# Altium schematic sheet Management.SchDoc: SVPXFMC Carrier 3U
size A4; CheckedBy: \; Author: G.Kasprowicz; CompanyName: ISE; DrawnBy: T.Przywozki; Organization: WUT ISE; Address1: Warsaw University of Technology; Address2: Nowowiejska 15/19 00-665 Warsaw; Revision: 1.0.; SheetNumber: 16; SheetTotal: 20; Project: SVPXFMC Carrier 3U; ModifiedBy: -; CheckedDate: -; Title2: MSP430 management MCU; DivGrp: ISE; Designer: G. Kasprowicz
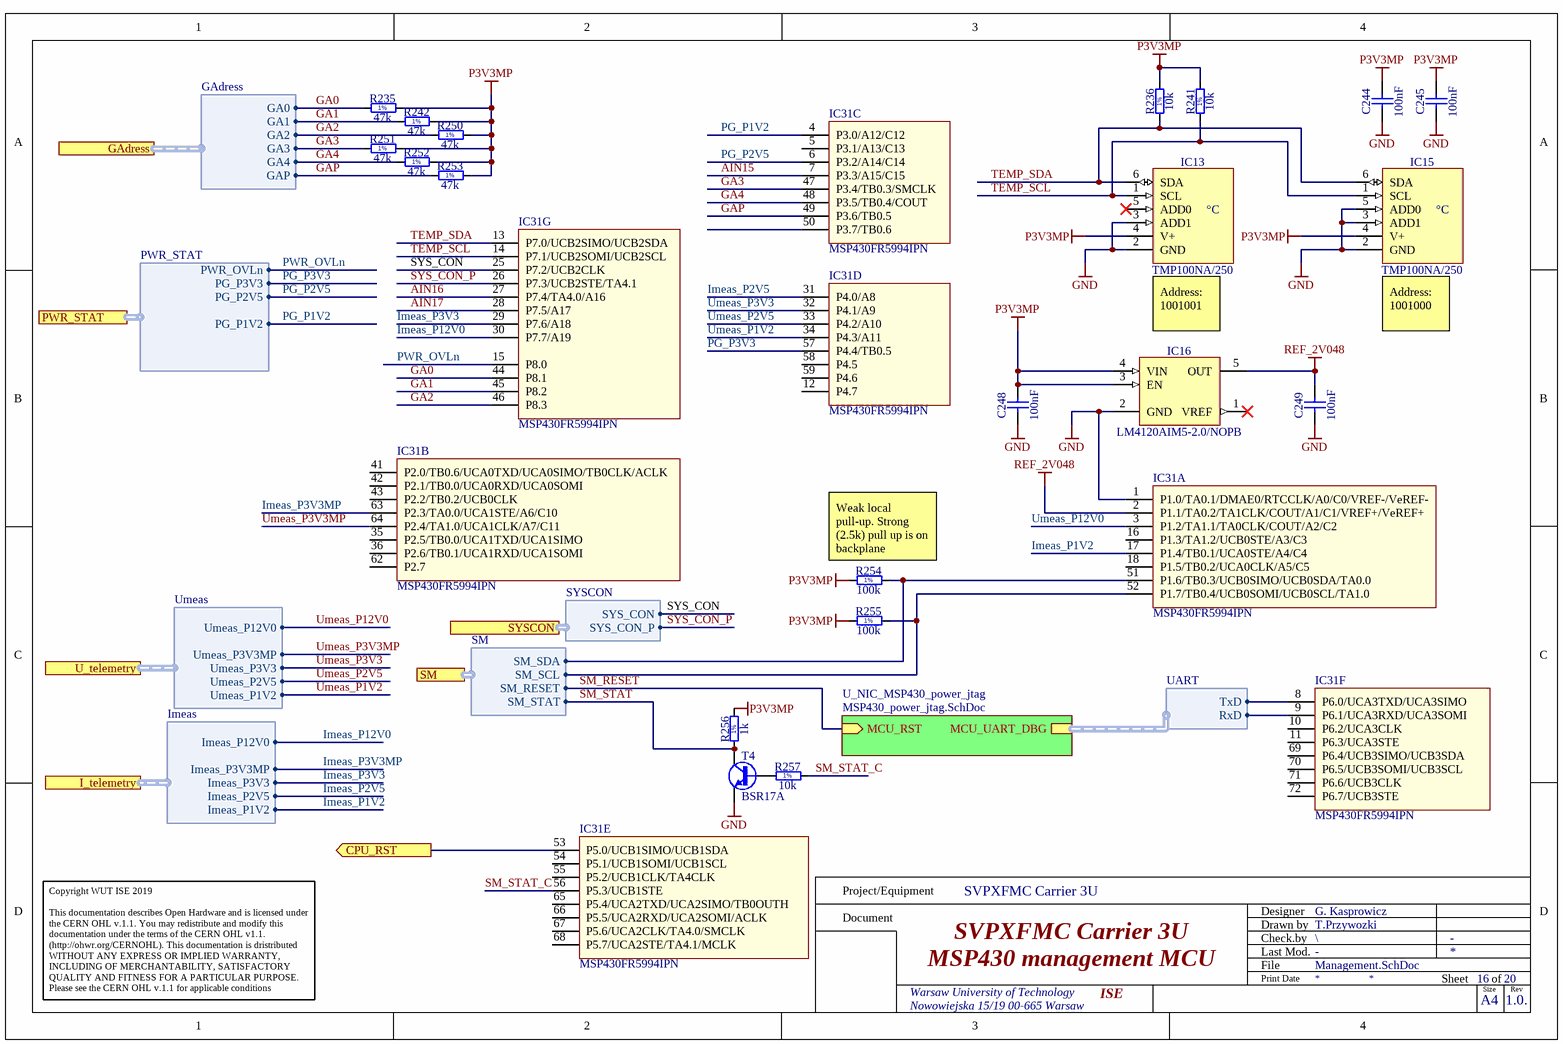
[diagram p0: Management.SchDoc]

## Parts
C244  100nF  [CAPC1005X55N]
C245  100nF  [CAPC1005X55N]
C248  100nF  [CAPC1005X55N]
C249  100nF  [CAPC1005X55N]
IC13  TMP100NA/250  [SOT95P280X145-6N]
IC15  TMP100NA/250  [SOT95P280X145-6N]
IC16  LM4120AIM5-2.0/NOPB  [SOT95P280X145-5N]
IC31  MSP430FR5994IPN  [PQFP50P1400X1400-80N]  (parts A,B,C,D,E,F,G of 9)
R235  47k  [RESC1005X40N]
R236  10k  [RESC1005X40N]
R241  10k  [RESC1005X40N]
R242  47k  [RESC1005X40N]
R250  47k  [RESC1005X40N]
R251  47k  [RESC1005X40N]
R252  47k  [RESC1005X40N]
R253  47k  [RESC1005X40N]
R254  100k  [RESC1005X40N]
R255  100k  [RESC1005X40N]
R256  1k  [RESC1005X40N]
R257  10k  [RESC1005X40N]
T4  BSR17A  [SOT95P240X110-3N]

## Sub-sheets
U_NIC_MSP430_power_jtag = MSP430_power_jtag.SchDoc: MCU_UART_DBG (harness UART), MCU_RST (in)

## Ports
CPU_RST (out), GAdress (harness GAdress), I_telemetry (harness Imeas), PWR_STAT (harness PWR_STAT), SM (harness SM), SYSCON (harness SYSCON), U_telemetry (harness Umeas)

## Harnesses
UART: TxD, RxD
SM: SM_SCL, SM_SDA, SM_RESET, SM_STAT
GAdress: GA0, GA1, GA2, GA3, GA4, GAP
PWR_STAT: PG_P1V2, PG_P2V5, PG_P3V3, PWR_OVLn
SYSCON: SYS_CON, SYS_CON_P
Imeas: Imeas_P12V0, Imeas_P3V3, Imeas_P2V5, Imeas_P1V2, Imeas_P3V3MP
Umeas: Umeas_P12V0, Umeas_P3V3, Umeas_P2V5, Umeas_P1V2, Umeas_P3V3MP

## Nets
GND: C244.1 C245.1 C248.1 C249.1 IC13.2(GND) IC13.3(ADD1) IC15.2(GND) IC15.3(ADD1) IC15.5(ADD0) IC16.2(GND) IC31.1(P1.0/TA0.1/DMAE0/RTCCLK/A0/C0/VREF-/VeREF-) T4.2(E)
P3V3MP: C244.2 C245.2 C248.2 IC13.4(V+) IC15.4(V+) IC16.3(EN) IC16.4(VIN) R235.2 R236.2 R241.2 R242.2 R250.2 R251.2 R252.2 R253.2 R254.1 R255.1 R256.2
REF_2V048: C249.2 IC16.5(OUT) IC31.2(P1.1/TA0.2/TA1CLK/COUT/A1/C1/VREF+/VeREF+)
AIN15: IC31.7(P3.3/A15/C15)
AIN16: IC31.27(P7.4/TA4.0/A16)
AIN17: IC31.28(P7.5/A17)
CPU_RST: IC31.53(P5.0/UCB1SIMO/UCB1SDA) ; port CPU_RST
GA0: IC31.44(P8.1) R235.1 ; port GAdress.GA0
GA1: IC31.45(P8.2) R242.1 ; port GAdress.GA1
GA2: IC31.46(P8.3) R250.1 ; port GAdress.GA2
GA3: IC31.47(P3.4/TB0.3/SMCLK) R251.1 ; port GAdress.GA3
GA4: IC31.48(P3.5/TB0.4/COUT) R252.1 ; port GAdress.GA4
GAP: IC31.49(P3.6/TB0.5) R253.1 ; port GAdress.GAP
Imeas_P1V2: IC31.17(P1.4/TB0.1/UCA0STE/A4/C4) ; port I_telemetry.Imeas_P1V2
Imeas_P2V5: IC31.31(P4.0/A8) ; port I_telemetry.Imeas_P2V5
Imeas_P3V3: IC31.29(P7.6/A18) ; port I_telemetry.Imeas_P3V3
Imeas_P3V3MP: IC31.63(P2.3/TA0.0/UCA1STE/A6/C10) ; port I_telemetry.Imeas_P3V3MP
Imeas_P12V0: IC31.30(P7.7/A19) ; port I_telemetry.Imeas_P12V0
PG_P1V2: IC31.4(P3.0/A12/C12) ; port PWR_STAT.PG_P1V2
PG_P2V5: IC31.6(P3.2/A14/C14) ; port PWR_STAT.PG_P2V5
PG_P3V3: IC31.57(P4.4/TB0.5) ; port PWR_STAT.PG_P3V3
PWR_OVLn: IC31.15(P8.0) ; port PWR_STAT.PWR_OVLn
SM_RESET: sheet U_NIC_MSP430_power_jtag/MCU_RST, port SM.SM_RESET
SM_STAT: R256.1 T4.3(C) ; port SM.SM_STAT
SM_STAT_C: IC31.56(P5.3/UCB1STE) R257.2
SYS_CON: IC31.25(P7.2/UCB2CLK) ; port SYSCON.SYS_CON
SYS_CON_P: IC31.26(P7.3/UCB2STE/TA4.1) ; port SYSCON.SYS_CON_P
TEMP_SCL: IC13.1(SCL) IC15.1(SCL) IC31.14(P7.1/UCB2SOMI/UCB2SCL) R241.1
TEMP_SDA: IC13.6(SDA) IC15.6(SDA) IC31.13(P7.0/UCB2SIMO/UCB2SDA) R236.1
Umeas_P1V2: IC31.34(P4.3/A11) ; port U_telemetry.Umeas_P1V2
Umeas_P2V5: IC31.33(P4.2/A10) ; port U_telemetry.Umeas_P2V5
Umeas_P3V3: IC31.32(P4.1/A9) ; port U_telemetry.Umeas_P3V3
Umeas_P3V3MP: IC31.64(P2.4/TA1.0/UCA1CLK/A7/C11) ; port U_telemetry.Umeas_P3V3MP
Umeas_P12V0: IC31.3(P1.2/TA1.1/TA0CLK/COUT/A2/C2) ; port U_telemetry.Umeas_P12V0
NetIC31_8: IC31.8(P6.0/UCA3TXD/UCA3SIMO) ; sheet U_NIC_MSP430_power_jtag/MCU_UART_DBG.TxD
NetIC31_9: IC31.9(P6.1/UCA3RXD/UCA3SOMI) ; sheet U_NIC_MSP430_power_jtag/MCU_UART_DBG.RxD
NetIC31_51: IC31.51(P1.6/TB0.3/UCB0SIMO/UCB0SDA/TA0.0) R254.2 ; port SM.SM_SDA
NetIC31_52: IC31.52(P1.7/TB0.4/UCB0SOMI/UCB0SCL/TA1.0) R255.2 ; port SM.SM_SCL
NetR257_1: R257.1 T4.1(B)

Not connected (* = marked no-connect by the designer): IC13 5(ADD0)*; IC16 1(VREF)*; IC31 5(P3.1/A13/C13) 10(P6.2/UCA3CLK) 11(P6.3/UCA3STE) 12(P4.7) 16(P1.3/TA1.2/UCB0STE/A3/C3) 18(P1.5/TB0.2/UCA0CLK/A5/C5) 35(P2.5/TB0.0/UCA1TXD/UCA1SIMO) 36(P2.6/TB0.1/UCA1RXD/UCA1SOMI) 41(P2.0/TB0.6/UCA0TXD/UCA0SIMO/TB0CLK/ACLK) 42(P2.1/TB0.0/UCA0RXD/UCA0SOMI) 43(P2.2/TB0.2/UCB0CLK) 50(P3.7/TB0.6) 54(P5.1/UCB1SOMI/UCB1SCL) 55(P5.2/UCB1CLK/TA4CLK) 58(P4.5) 59(P4.6) 62(P2.7) 65(P5.4/UCA2TXD/UCA2SIMO/TB0OUTH) 66(P5.5/UCA2RXD/UCA2SOMI/ACLK) 67(P5.6/UCA2CLK/TA4.0/SMCLK) 68(P5.7/UCA2STE/TA4.1/MCLK) 69(P6.4/UCB3SIMO/UCB3SDA) 70(P6.5/UCB3SOMI/UCB3SCL) 71(P6.6/UCB3CLK) 72(P6.7/UCB3STE)

## Notes on the sheet
- Address: 1001001
- (near IC15) Address: 1001000
- (near R254) Weak local pull-up. Strong (2.5k) pull up is on backplane
- Project/Equipment
- Document
- Designer
- Drawn by
- Check.by
- Copyright WUT ISE 2019
  This documentation describes Open Hardware and is licensed under the CERN OHL v.1.1. You may redistribute and modify this documentation under the terms of the CERN OHL v1.1.
  (http://ohwr.org/CERNOHL). This documentation is dristributed WITHOUT ANY EXPRESS OR IMPLIED WARRANTY, INCLUDING OF MERCHANTABILITY, SATISFACTORY QUALITY AND FITNESS FOR A PARTICULAR PURPOSE. Please see the CERN OHL v.1.1 for applicable conditions
- File
- Last Mod.
- Print Date
- Sheet
- Size
- A4
- of
- Rev
- (in symbol R0402_1K_1%_0.0625W_100PPM) 1%
- (in symbol R0402_10K_1%_0.0625W_100PPM) 1%
- (in symbol R0402_47K_1%_0.0625W_100PPM) 1%
- (in symbol R0402_100K_1%_0.0625W_100PPM) 1%
- (in symbol TMP100NA/250) °C

## Library data of the parts
C244 C245 C248 C249 = CC0402_100NF_25V_10%_X7R_YUDEN_TMK105B7104KVHF: Non-polarised capacitor; Part Description: SMD Multilayer Chip Ceramic Capacitor (High Dielectric Type) for Automotive / Industrial Applications; Manufacturer: TAIYO YUDEN; Voltage: 25V; TC: X7R; Tolerance: ±10%; Part Number: CC0402_100NF_25V_10%_X7R_YUDEN_TMK105B7104KVHF; Component Kind: Standard; Component Type: Standard; Pin Count: 2; Value: 100nF; Status: Not Recommended; Manufacturer Part Number: TMK105B7104KVHF; Case: 0402; Mounted: Yes; Socket: No; SMD: Yes; Sense: No; HelpURL: \\cern.ch\dfs\Applications\Altium\Datasheets\CC0402_TAIYO-YUDEN_TMK105B7104KVHF.pdf; Author: CERN DEM JLC; ComponentHeight: 0.55mm
  C244 C245: CreateDate: 10/05/2017; LatestRevisionDate: 10/05/2017
  C248 C249: CreateDate: 10.05.2017; LatestRevisionDate: 10.05.2017
IC13 IC15 = TMP100NA/250: Digital Temperature Sensor with I2C Interface; Part Description: -55°C to +125°C, ±3.0°C Accuracy, Digital Temperature Sensor with I2C Interface; Manufacturer: TEXAS INSTRUMENTS; PressFit: No; Bonding: No; Part Number: TMP100NA/250; Component Kind: Standard; Component Type: Standard; Device: TMP100NA/250; PackageDescription: SOT23, 6-Leads, Body 1.6x3.0mm, Pitch 0.95mm, IPC Medium Density; Manufacturer Part Number: TMP100NA/250; Pin Count: 6; Case: SOT23-6; Mounted: Yes; Socket: No; SMD: Yes; Sense: No; ComponentHeight: 1.45mm; HelpURL: \\cern.ch\dfs\Applications\Altium\Datasheets\TMP100NA-250.pdf; Author: CERN DEM JLC; CreateDate: 29.10.2012; LatestRevisionDate: 29.10.2012
IC16 = LM4120AIM5-2.0/NOPB: Precision Micropower Low Dropout Voltage Reference; Part Description: 2.048V Precision Micropower Low Dropout Voltage Reference; Manufacturer: TEXAS INSTRUMENTS; PressFit: No; Bonding: No; Part Number: LM4120AIM5-2.0/NOPB; Component Kind: Standard; Component Type: Standard; Device: LM4120AIM5-2.0/NOPB; PackageDescription: SOT, 0.95mm Pitch; 5 Pin, 1.60mm W X 2.90mm L X 1.45mm H Body, IPC Medium Density; Manufacturer Part Number: LM4120AIM5-2.0/NOPB; Pin Count: 5; Case: SOT23-5; Mounted: Yes; Socket: No; SMD: Yes; Sense: No; ComponentHeight: 1.45mm; HelpURL: \\cern.ch\dfs\Applications\Altium\Datasheets\LM4120AIM5-2.0-NOPB.pdf; Author: CERN DEM JMW; CreateDate: 2016-08-31; LatestRevisionDate: 2016-08-31
IC31 = MSP430FR5994IPN: Manufacturer: TI; Part Description: FRAM microcontroller; Bonding: No; ComponentHeigth: 2mm; PressFit: No; Case: LQFP80; Component Kind: Standard; Component Type: Standard; CreateDate: 2018-01-01; Device: MSP430FR5994IPN; Footprint: LQFP80; HelpURL: *; LatestRevisionDate: 2018-01-01; Manufacturer Part Number: MSP430FR5994IPN; Mounted: Yes; PackageDescription: LQFP80; Part Number: MSP430FR5994IPN; Pin Count: 80; Sense: No; SMD: Yes; Socket: No; Value: *
R235 R242 R250-R253 = R0402_47K_1%_0.0625W_100PPM: Resistor - 1%; Part Description: General Purpose Thick Film Chip Resistor; Manufacturer: GENERIC; Manufacturer1 Part Number: 232270675103L; TC: ±100ppm/°C; PressFit: No; Part Number: R0402_47K_1%_0.0625W_100PPM; Component Kind: Standard; Component Type: Standard; Pin Count: 2; Value: 47k; Status: Not Recommended; Power: 0.0625W; Tolerance: ±1%; Manufacturer Part Number: R0402_47K_1%_0.0625W_100PPM; Case: 0402; Mounted: Yes; Sense: No; Socket: No; SMD: Yes; Manufacturer1 Example: YAGEO PHYCOMP; Manufacturer1 ComponentHeight: 0.4mm; HelpURL: \\cern.ch\dfs\Applications\Altium\Datasheets\R0402_Phycomp_RC0402.pdf; Author: CERN DEM JLC; CreateDate: 03.12.2007; LatestRevisionDate: 17.10.2012
R236 R241 R257 = R0402_10K_1%_0.0625W_100PPM: Resistor - 1%; Part Description: General Purpose Thick Film Chip Resistor; Manufacturer: GENERIC; Manufacturer1 Part Number: 232270671003L; TC: ±100ppm/°C; PressFit: No; Part Number: R0402_10K_1%_0.0625W_100PPM; Component Kind: Standard; Component Type: Standard; Pin Count: 2; Value: 10k; Status: Not Recommended; Power: 0.0625W; Tolerance: ±1%; Manufacturer Part Number: R0402_10K_1%_0.0625W_100PPM; Case: 0402; Mounted: Yes; Sense: No; Socket: No; SMD: Yes; Manufacturer1 Example: YAGEO PHYCOMP; Manufacturer1 ComponentHeight: 0.4mm; HelpURL: \\cern.ch\dfs\Applications\Altium\Datasheets\R0402_Phycomp_RC0402.pdf; Author: CERN DEM JLC
  R236 R241: CreateDate: 03.12.2007; LatestRevisionDate: 17.10.2012
  R257: CreateDate: 03/12/2007; LatestRevisionDate: 17/10/2012
R254 R255 = R0402_100K_1%_0.0625W_100PPM: Resistor - 1%; Part Description: General Purpose Thick Film Chip Resistor; Manufacturer: GENERIC; Manufacturer1 Part Number: 232270671004L; TC: ±100ppm/°C; PressFit: No; Part Number: R0402_100K_1%_0.0625W_100PPM; Component Kind: Standard; Component Type: Standard; Pin Count: 2; Value: 100k; Status: Not Recommended; Power: 0.0625W; Tolerance: ±1%; Manufacturer Part Number: R0402_100K_1%_0.0625W_100PPM; Case: 0402; Mounted: Yes; Sense: No; Socket: No; SMD: Yes; Manufacturer1 Example: YAGEO PHYCOMP; Manufacturer1 ComponentHeight: 0.4mm; HelpURL: \\cern.ch\dfs\Applications\Altium\Datasheets\R0402_Phycomp_RC0402.pdf; Author: CERN DEM JLC; CreateDate: 03.12.2007; LatestRevisionDate: 17.10.2012
R256 = R0402_1K_1%_0.0625W_100PPM: Resistor - 1%; Part Description: General Purpose Thick Film Chip Resistor; Manufacturer: GENERIC; Manufacturer1 Part Number: 232270671002L; TC: ±100ppm/°C; PressFit: No; Part Number: R0402_1K_1%_0.0625W_100PPM; Component Kind: Standard; Component Type: Standard; Pin Count: 2; Value: 1k; Status: Not Recommended; Power: 0.0625W; Tolerance: ±1%; Manufacturer Part Number: R0402_1K_1%_0.0625W_100PPM; Case: 0402; Mounted: Yes; Sense: No; Socket: No; SMD: Yes; Manufacturer1 Example: YAGEO PHYCOMP; Manufacturer1 ComponentHeight: 0.4mm; HelpURL: \\cern.ch\dfs\Applications\Altium\Datasheets\R0402_Phycomp_RC0402.pdf; Author: CERN DEM JLC; CreateDate: 03.12.2007; LatestRevisionDate: 17.10.2012
T4 = BSR17A: NPN Transistor; Part Description: 40V 200mA NPN General-Purpose Amplifier; Manufacturer: FAIRCHILD SEMICONDUCTOR; PressFit: No; Bonding: No; Part Number: BSR17A; Component Kind: Standard; Component Type: Standard; Device: BSR17A; PackageDescription: SOT23 3-Leads, Pitch 0.95mm - Body 1.4x3mm, IPC Medium Density; Manufacturer Part Number: BSR17A; Pin Count: 3; Case: SOT23-3; Mounted: Yes; Socket: No; SMD: Yes; Sense: No; ComponentHeight: 1.3mm; HelpURL: \\cern.ch\dfs\Applications\Altium\Datasheets\BSR17A.pdf; Author: CERN DEM JLC; CreateDate: 14.05.2008; LatestRevisionDate: 14.05.2008